# EasyEDA schematic 1-Schematic_Mosfet board.json
TITLE: Sheet_1; REV: 1.0; Date: 2020-12-25; Sheet: 1/1; Drawn By: Erik Riedel; Company: Erik Inc.
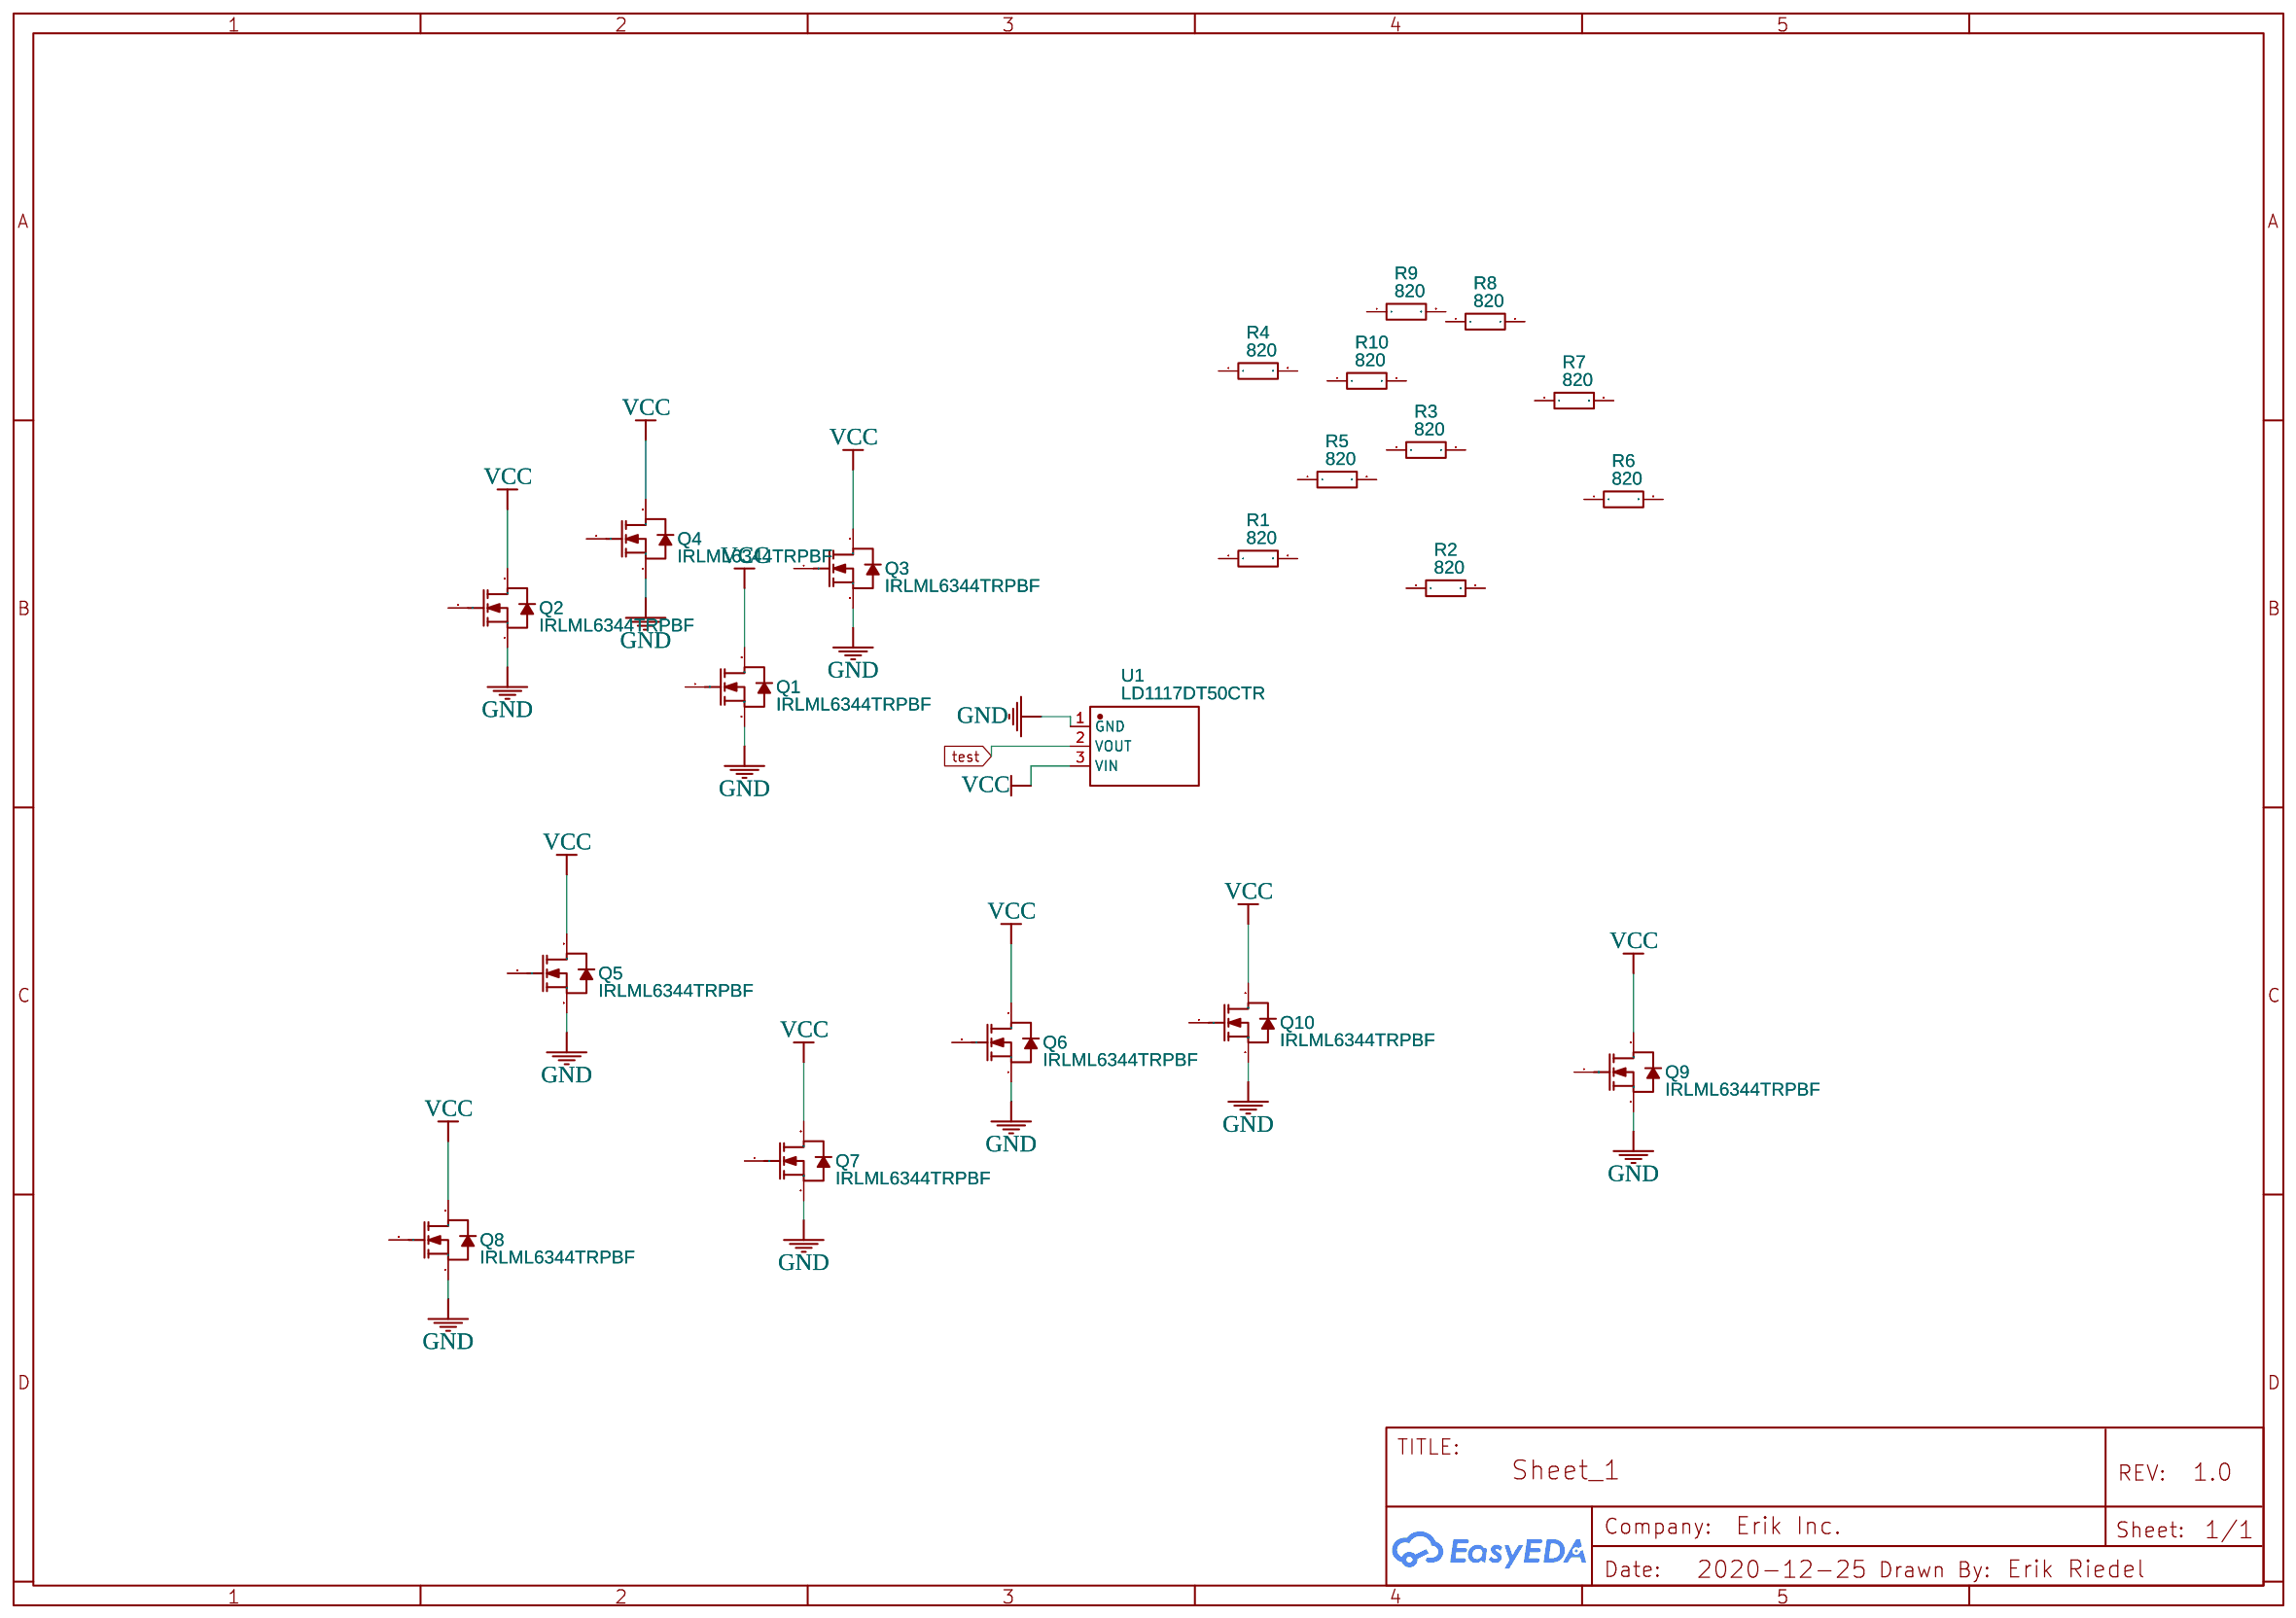
[diagram p0: schematic sheet]

## Parts
Q1  IRLML6344TRPBF  [SOT-23-3_L2.9-W1.6-P1.90-LS2.8-BR]
Q2  IRLML6344TRPBF  [SOT-23-3_L2.9-W1.6-P1.90-LS2.8-BR]
Q3  IRLML6344TRPBF  [SOT-23-3_L2.9-W1.6-P1.90-LS2.8-BR]
Q4  IRLML6344TRPBF  [SOT-23-3_L2.9-W1.6-P1.90-LS2.8-BR]
Q5  IRLML6344TRPBF  [SOT-23-3_L2.9-W1.6-P1.90-LS2.8-BR]
Q6  IRLML6344TRPBF  [SOT-23-3_L2.9-W1.6-P1.90-LS2.8-BR]
Q7  IRLML6344TRPBF  [SOT-23-3_L2.9-W1.6-P1.90-LS2.8-BR]
Q8  IRLML6344TRPBF  [SOT-23-3_L2.9-W1.6-P1.90-LS2.8-BR]
Q9  IRLML6344TRPBF  [SOT-23-3_L2.9-W1.6-P1.90-LS2.8-BR]
Q10  IRLML6344TRPBF  [SOT-23-3_L2.9-W1.6-P1.90-LS2.8-BR]
R1  820  [R0603]
R2  820  [R0603]
R3  820  [R0603]
R4  820  [R0603]
R5  820  [R0603]
R6  820  [R0603]
R7  820  [R0603]
R8  820  [R0603]
R9  820  [R0603]
R10  820  [R0603]
U1  LD1117DT50CTR  [TO-252-2_L6.6-W6.1-P4.57-LS9.9-TL-CW]

## Library data of the parts
Q1-Q10 = IRLML6344TRPBF: Supplier: LCSC; Manufacturer: IR; Contributor: LCSC; Supplier Part: C53550; SMT Type: Extend; JLCPCB SMD: Yes
R1-R10 = 0603WAF8200T5E: Supplier: LCSC; Manufacturer: UniOhm; Supplier Part: C23253; SMT Type: Basic; JLCPCB SMD: Yes
U1 = LD1117DT50CTR: Supplier: LCSC; Manufacturer: STMicroelectronics; Contributor: LCSC; Supplier Part: C93063; SMT Type: Extend; JLCPCB SMD: Yes

## Nets
GND: Q1.2(S) Q2.2(S) Q3.2(S) Q4.2(S) Q5.2(S) Q6.2(S) Q7.2(S) Q8.2(S) Q9.2(S) Q10.2(S) U1.1(GND)
VCC: Q1.3(D) Q2.3(D) Q3.3(D) Q4.3(D) Q5.3(D) Q6.3(D) Q7.3(D) Q8.3(D) Q9.3(D) Q10.3(D) U1.3(VIN)
test: U1.2(VOUT)

Not connected (* = marked no-connect by the designer): Q1 1(G); Q2 1(G); Q3 1(G); Q4 1(G); Q5 1(G); Q6 1(G); Q7 1(G); Q8 1(G); Q9 1(G); Q10 1(G); R1 1 2; R2 1 2; R3 1 2; R4 1 2; R5 1 2; R6 1 2; R7 1 2; R8 1 2; R9 1 2; R10 1 2
